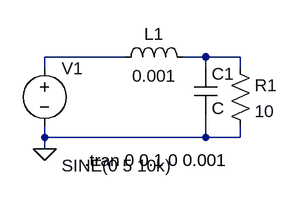
[diagram p0: schematic Draft1.asc]
Draft1.asc, the LTspice schematic file:
Version 4
SHEET 1 880 680
WIRE 112 128 0 128
WIRE 224 128 192 128
WIRE 272 128 224 128
WIRE 0 144 0 128
WIRE 224 144 224 128
WIRE 272 144 272 128
WIRE 0 240 0 224
WIRE 224 240 224 208
WIRE 224 240 0 240
WIRE 272 240 272 224
WIRE 272 240 224 240
WIRE 0 256 0 240
FLAG 0 256 0
SYMBOL voltage 0 128 R0
WINDOW 3 24 152 Left 2
WINDOW 123 24 124 Left 2
WINDOW 39 0 0 Left 0
SYMATTR InstName V1
SYMATTR Value SINE(0 5 10k)
SYMBOL ind 96 144 R270
WINDOW 0 32 56 VTop 2
WINDOW 3 5 56 VBottom 2
SYMATTR InstName L1
SYMATTR Value 0.001
SYMBOL res 256 128 R0
SYMATTR InstName R1
SYMATTR Value 10
SYMBOL cap 208 144 R0
SYMATTR InstName C1
TEXT 56 272 Left 2 !.tran 0 0.1 0 0.001

The netlist it stands for:
* Draft1.asc
V1 N001 0 SINE(0 5 10k)
L1 N001 N002 0.001
R1 N002 0 10
C1 N002 0 C
.tran 0 0.1 0 0.001
.backanno
.end